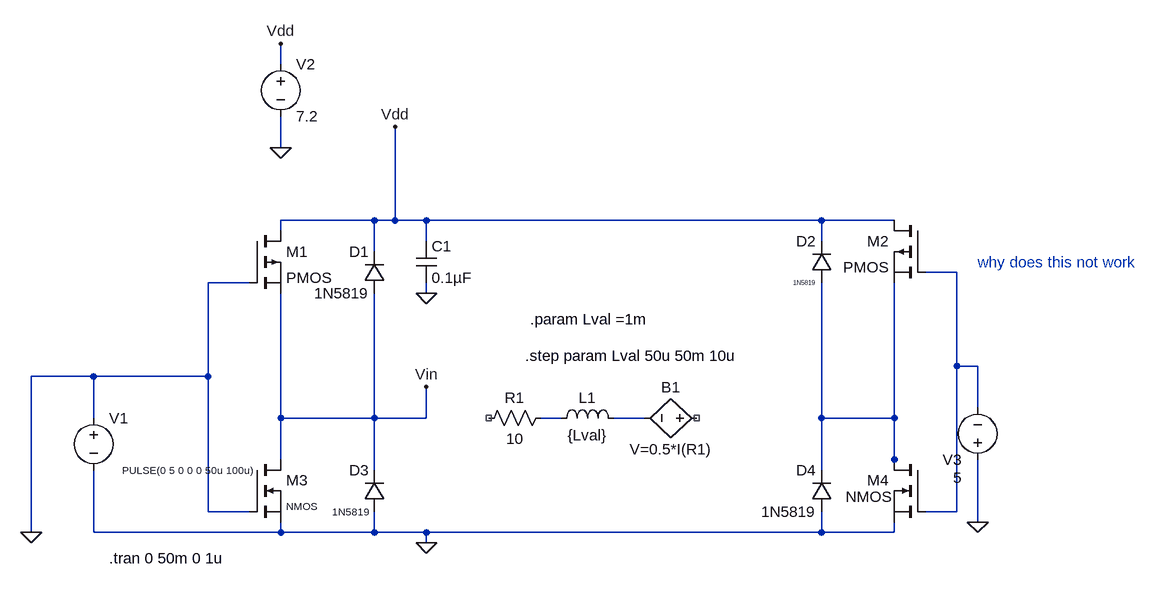
[diagram p0: schematic rl series_GETTING BETTER.asc]
rl series_GETTING BETTER.asc, the LTspice schematic file:
Version 4.1
SHEET 1 1188 1528
WIRE -384 272 -384 240
WIRE -384 400 -384 352
WIRE -240 512 -384 512
WIRE -208 512 -208 368
WIRE -208 512 -240 512
WIRE -160 512 -208 512
WIRE 448 512 -160 512
WIRE 560 512 448 512
WIRE -384 528 -384 512
WIRE -160 544 -160 512
WIRE 448 544 448 512
WIRE -240 560 -240 512
WIRE 656 592 608 592
WIRE -432 608 -496 608
WIRE -160 624 -160 608
WIRE 656 736 656 592
WIRE 688 736 656 736
WIRE -672 752 -768 752
WIRE -496 752 -496 608
WIRE -496 752 -672 752
WIRE 688 800 688 736
WIRE -672 816 -672 752
WIRE -384 816 -384 624
WIRE -240 816 -240 624
WIRE -240 816 -384 816
WIRE -160 816 -160 768
WIRE -160 816 -240 816
WIRE 48 816 16 816
WIRE 176 816 128 816
WIRE 448 816 448 608
WIRE 560 816 560 608
WIRE 560 816 448 816
WIRE -384 880 -384 816
WIRE 560 880 560 816
WIRE -240 896 -240 816
WIRE 448 896 448 816
WIRE 560 896 560 880
WIRE -496 960 -496 752
WIRE -432 960 -496 960
WIRE 656 960 656 736
WIRE 656 960 608 960
WIRE 688 976 688 880
WIRE -768 992 -768 752
WIRE -672 992 -672 896
WIRE -384 992 -384 976
WIRE -384 992 -672 992
WIRE -240 992 -240 960
WIRE -240 992 -384 992
WIRE -160 992 -240 992
WIRE 448 992 448 960
WIRE 448 992 -160 992
WIRE 560 992 560 976
WIRE 560 992 448 992
WIRE -160 1008 -160 992
FLAG -208 368 Vdd
FLAG -160 1008 0
FLAG -384 240 Vdd
FLAG -384 400 0
FLAG -160 768 Vin
FLAG -160 624 0
FLAG -768 992 0
FLAG 688 976 0
SYMBOL res 32 800 R90
WINDOW 0 0 56 VBottom 2
WINDOW 3 32 56 VTop 2
SYMATTR InstName R1
SYMATTR Value 10
SYMBOL ind 32 832 R270
WINDOW 0 32 56 VTop 2
WINDOW 3 5 56 VBottom 2
SYMATTR InstName L1
SYMATTR Value {Lval}
SYMATTR SpiceLine Rser=1m
SYMBOL bv 272 816 R90
WINDOW 0 -32 56 VBottom 2
WINDOW 3 32 56 VTop 2
SYMATTR InstName B1
SYMATTR Value V=0.5*I(R1)
SYMBOL pmos -432 528 R0
SYMATTR InstName M1
SYMBOL nmos -432 880 R0
WINDOW 3 56 72 Left 1
SYMATTR InstName M3
SYMBOL diode -224 624 R180
WINDOW 0 24 64 Left 2
WINDOW 3 24 0 Left 2
SYMATTR InstName D1
SYMATTR Value 1N5819
SYMBOL diode 464 608 R180
WINDOW 0 24 64 Left 2
WINDOW 3 24 0 Left 0
SYMATTR InstName D2
SYMATTR Value 1N5819
SYMBOL diode -224 960 R180
WINDOW 0 24 64 Left 2
WINDOW 3 24 0 Left 1
SYMATTR InstName D3
SYMATTR Value 1N5819
SYMBOL diode 464 960 R180
WINDOW 0 24 64 Left 2
WINDOW 3 24 0 Left 2
SYMATTR InstName D4
SYMATTR Value 1N5819
SYMBOL voltage -672 800 R0
WINDOW 3 242 96 Right 1
WINDOW 123 0 0 Left 0
WINDOW 39 0 0 Left 0
SYMATTR Value PULSE(0 5 0 0 0 50u 100u)
SYMATTR InstName V1
SYMBOL voltage -384 256 R0
WINDOW 123 0 0 Left 0
WINDOW 39 0 0 Left 0
SYMATTR InstName V2
SYMATTR Value 7.2
SYMBOL nmos 608 880 M0
WINDOW 3 51 57 Left 2
SYMATTR InstName M4
SYMBOL pmos 608 512 M0
SYMATTR InstName M2
SYMBOL cap -176 544 R0
SYMATTR InstName C1
SYMATTR Value 0.1µF
SYMBOL voltage 688 896 R180
WINDOW 3 24 -12 Left 2
WINDOW 123 0 0 Left 0
WINDOW 39 0 0 Left 0
SYMATTR Value 5
SYMATTR InstName V3
TEXT -8 720 Left 2 !.step param Lval 50u 50m 10u
TEXT 0 664 Left 2 !.param Lval =1m
TEXT -648 1032 Left 2 !.tran 0 50m 0 1u
TEXT 688 576 Left 2 ;why does this not work

The netlist it stands for:
* rl series_GETTING BETTER.asc
R1 N002 NC_01 10
L1 N002 N003 {Lval} Rser=1m
B1 NC_02 N003 V=0.5*I(R1)
M1 Vdd 0 Vin Vin PMOS
M3 Vin 0 0 0 NMOS
D1 Vin Vdd 1N5819
D2 N004 Vdd 1N5819
D3 0 Vin 1N5819
D4 0 N004 1N5819
V1 0 0 PULSE(0 5 0 0 0 50u 100u)
V2 Vdd 0 7.2
M4 N004 N001 0 0 NMOS
M2 Vdd N001 N004 N004 PMOS
C1 Vdd 0 0.1µF
V3 0 N001 5
.model D D
.lib standard.dio
.model NMOS NMOS
.model PMOS PMOS
.lib standard.mos
.step param Lval 50u 50m 10u
.param Lval =1m
.tran 0 50m 0 1u
* why does this not work
.backanno
.end